# Altium schematic sheet hud_v300_DISP.SchDoc
size A4; SheetNumber: 6; SheetTotal: 6
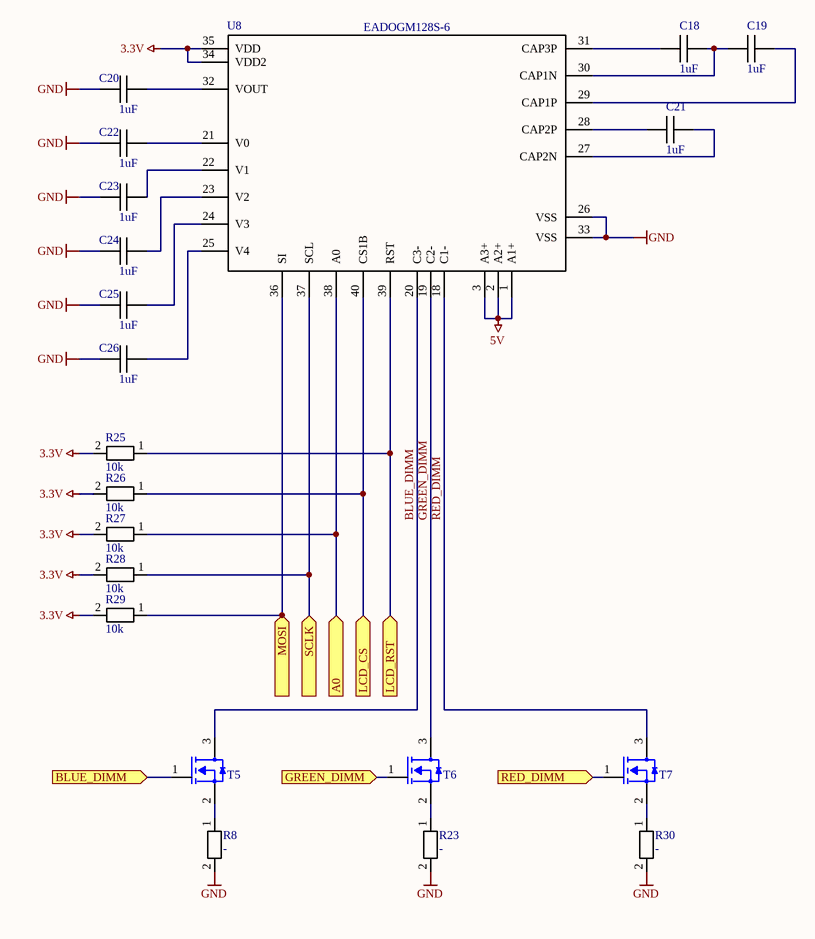
[diagram p0: hud_v300_DISP.SchDoc]

## Parts
C18  1uF  [0805_C]
C19  1uF  [0805_C]
C20  1uF  [0805_C]
C21  1uF  [0805_C]
C22  1uF  [0805_C]
C23  1uF  [0805_C]
C24  1uF  [0805_C]
C25  1uF  [0805_C]
C26  1uF  [0805_C]
R8  -  [0805]
R23  -  [0805]
R25  10k  [0805]
R26  10k  [0805]
R27  10k  [0805]
R28  10k  [0805]
R29  10k  [0805]
R30  -  [0805]
T5  MMBF170  [SOT23]  (value not drawn)
T6  MMBF170  [SOT23]  (value not drawn)
T7  MMBF170  [SOT23]  (value not drawn)
U8  EADOGM128S-6  [EADOGM128-S]

## Ports
A0 (in, see hud_v300_MAIN[1C], hud_v300_MCU[4C]), BLUE_DIMM (in, see hud_v300_MAIN[1D]), GREEN_DIMM (in, see hud_v300_MAIN[1C]), LCD_CS (in, see hud_v300_MAIN[1C]), LCD_RST (in, see hud_v300_MAIN[1C], hud_v300_MCU[4B]), MOSI (in, see hud_v300_MAIN[1C], hud_v300_MCU[3B]), RED_DIMM (in, see hud_v300_MAIN[1C]), SCLK (in, see hud_v300_MAIN[1C], hud_v300_MCU[3B])

## Nets
3.3V: R25.2 R26.2 R27.2 R28.2 R29.2 U8.34(VDD2) U8.35(VDD)
5V: U8.1(A1+) U8.2(A2+) U8.3(A3+)
GND: C20.1 C22.1 C23.1 C24.1 C25.1 C26.1 R8.2 R23.2 R30.2 U8.26(VSS) U8.33(VSS)
A0: R27.1 U8.38(A0) ; port A0
BLUE_DIMM: T5.3(Drain) U8.20(C3-)
BLUE_DIMM: T5.1(Gate) ; port BLUE_DIMM  [a separate net that carries the same name]
GREEN_DIMM: T6.3(Drain) U8.19(C2-)
GREEN_DIMM: T6.1(Gate) ; port GREEN_DIMM  [a separate net that carries the same name]
LCD_CS: R26.1 U8.40(CS1B) ; port LCD_CS
LCD_RST: R25.1 U8.39(RST) ; port LCD_RST
MOSI: R29.1 U8.36(SI) ; port MOSI
RED_DIMM: T7.3(Drain) U8.18(C1-)
RED_DIMM: T7.1(Gate) ; port RED_DIMM  [a separate net that carries the same name]
SCLK: R28.1 U8.37(SCL) ; port SCLK
NetC18_1: C18.1 C19.2 U8.30(CAP1N)
NetC18_2: C18.2 U8.31(CAP3P)
NetC19_1: C19.1 U8.29(CAP1P)
NetC20_2: C20.2 U8.32(VOUT)
NetC21_1: C21.1 U8.27(CAP2N)
NetC21_2: C21.2 U8.28(CAP2P)
NetC22_2: C22.2 U8.21(V0)
NetC23_2: C23.2 U8.22(V1)
NetC24_2: C24.2 U8.23(V2)
NetC25_2: C25.2 U8.24(V3)
NetC26_2: C26.2 U8.25(V4)
NetR8_1: R8.1 T5.2(Source)
NetR23_1: R23.1 T6.2(Source)
NetR30_1: R30.1 T7.2(Source)

## Library data of the parts
C18-C26 = CAPACITOR
R8 R23 R30 = RESISTOR: Parameter 1: 10k
R25-R29 = RESISTOR: Parameter 1: 10k
T5-T7 = MMBF170: N MOSFET
U8 = EADOGM128S-6: 128x64 LCD Module with custom RGB Backlight